# EAGLE design TalonSRXBreakoutV1 (EAGLE 7.5.0)
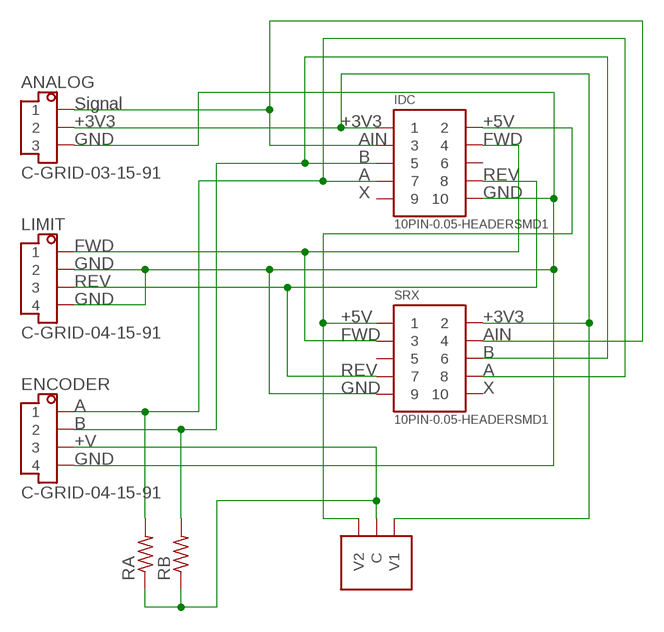
[diagram p0: schematic, sheet 1]

## Parts
ANALOG  C-GRID-03-15-91  [15-91-03]
ENCODER  C-GRID-04-15-91  [15-91-04]
IDC  10PIN-0.05-HEADERSMD1  [1.27-10PIN]
LIMIT  C-GRID-04-15-91  [15-91-04]
RA  R-US_R0805  [R0805]
RB  R-US_R0805  [R0805]
SRX  10PIN-0.05-HEADERSMD1  [1.27-10PIN]
U$1  3PIN-RA-VSELECT  [2.54-3PIN-SMD-RA]

## Nets
N$1: ANALOG.1 IDC.P3 SRX.P4
N$2: ANALOG.3 ENCODER.4 IDC.P10 LIMIT.2 LIMIT.4 SRX.P9
N$3: ANALOG.2 IDC.P1 SRX.P2 U$1.P1(V1)
N$4: IDC.P8 LIMIT.3 SRX.P7
N$5: IDC.P4 LIMIT.1 SRX.P3
N$7: ENCODER.1 IDC.P7 RA.2 SRX.P8
N$8: ENCODER.2 IDC.P5 RB.2 SRX.P6
N$11: IDC.P2 SRX.P1 U$1.P3(V2)
N$12: ENCODER.3 RA.1 RB.1 U$1.P2(C)
Unconnected: IDC.P6 IDC.P9 SRX.P5 SRX.P10

## Notes on the sheet
- Signal
- +3V3 | +3V3 | +5V
- GND | AIN | FWD
- B
- A | REV
- X | GND
- FWD
- GND
- REV
- GND
- +5V | +3V3
- FWD | AIN
- B
- REV | A
- GND | X
- A
- B
- +V
- GND

## Library data of the parts
ANALOG = con-molex:C-GRID-03: CONNECTOR wire to board 2.54 mm (0.100") pitch header; OC_FARNELL: unknown; OC_NEWARK: unknown
ENCODER LIMIT = con-molex:C-GRID-04: CONNECTOR wire to board 2.54 mm (0.100") pitch header; OC_FARNELL: unknown; OC_NEWARK: unknown
IDC SRX = con-CNC:10PIN-0.05-HEADER: Simple SMD 0.05" 10 pin header
RA RB = rcl:R-US_: RESISTOR, American symbol
U$1 = con-CNC:3PIN-RA-VSELECT

## Board
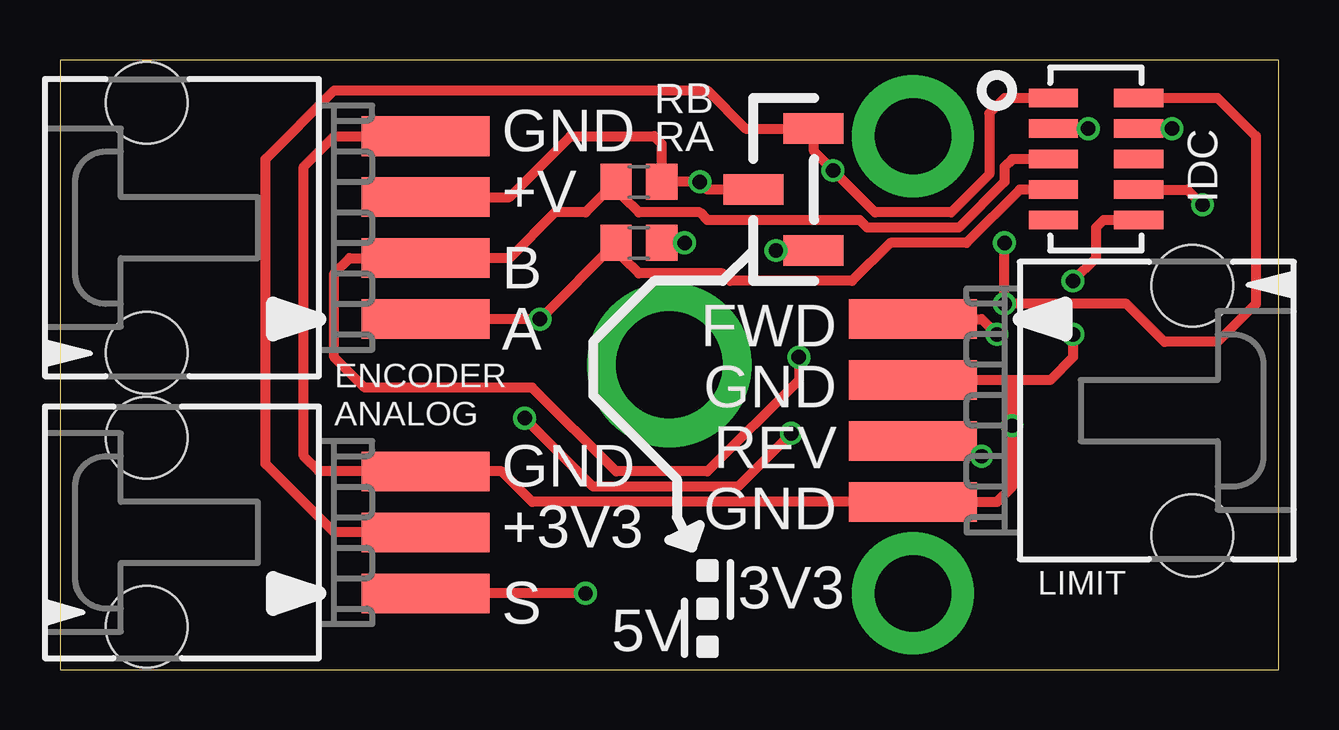
[diagram p1: board, top side]
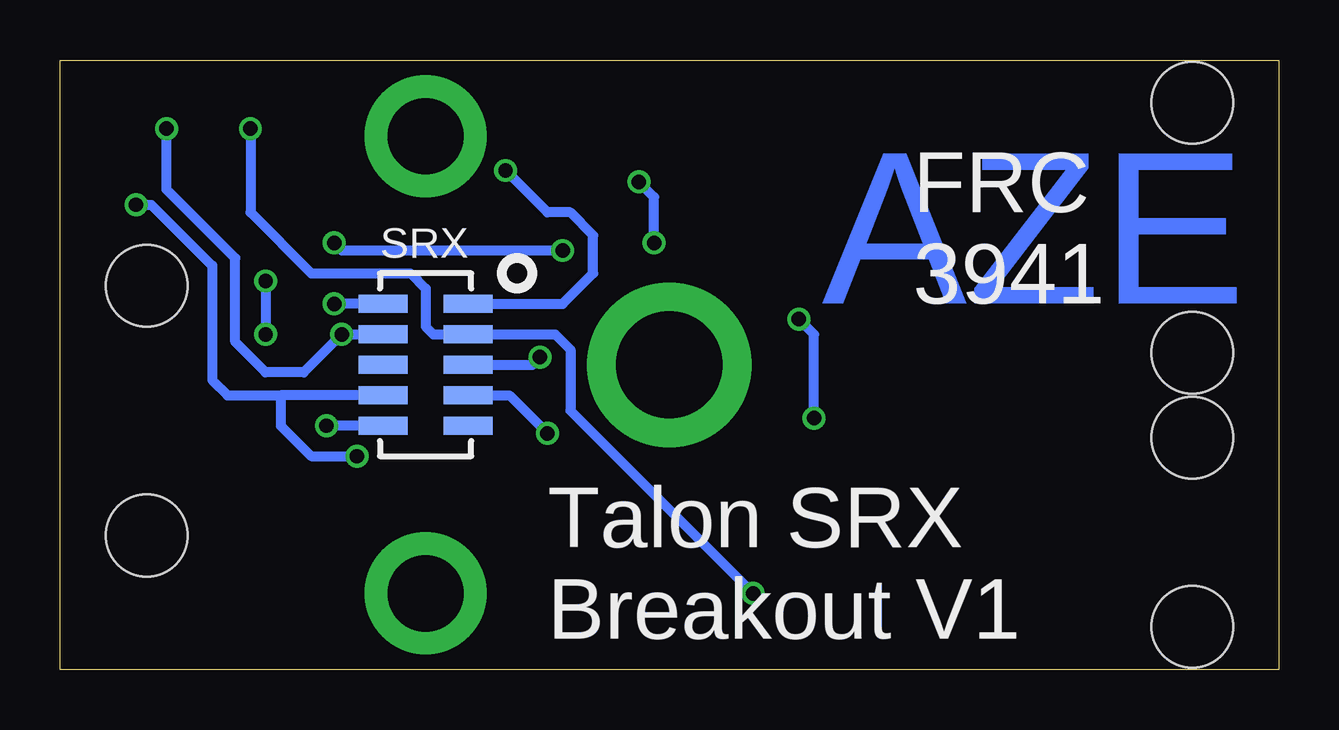
[diagram p2: board, bottom side, seen from below]

Size 50.8 x 25.4 mm. Coordinates in mm from the lower left corner, seen from the top.
Outline: 0,0 50.8,0 50.8,25.4 0,25.4 0,0
Copper layers (1*16): Top 0.0356mm / dielectric 1.5011mm / Bottom 0.0356mm
Design rules "LaenPCBOrder *": minimum track width 6mil, minimum drill 13mil, track to track 6mil, track to pad 6mil, pad to pad 6mil, via to via 6mil, smd to smd 0mil, copper to edge 15mil, drill to drill 6mil, minimum pad ring 7mil, minimum via ring 7mil, stop-mask expansion 3mil, vias tented up to drill 500mil, thermal gap 10mil

### Footprints (pad centres in the part's own frame; a part is rotated, then mirrored left to right if it is on the bottom)
15-91-03 = smd 1.651 x 5.334: 1 -2.54,-10.795; 2 0,-10.795; 3 2.54,-10.795 | hole 3.404: -3.937,0.838; 3.937,0.838
15-91-04 = smd 1.651 x 5.334: 1 -3.81,-10.795; 2 -1.27,-10.795; 3 1.27,-10.795; 4 3.81,-10.795 | hole 3.404: -5.207,0.838; 5.207,0.838
1.27-10PIN = smd 0.76 x 2.05: P1 2.54,1.775; P2 2.54,-1.775; P3 1.27,1.775; P4 1.27,-1.775; P5 0,1.775; P6 0,-1.775; P7 -1.27,1.775; P8 -1.27,-1.775; P9 -2.54,1.775; P10 -2.54,-1.775
R0805 = smd 1.3 x 1.5: 1 -0.95,0; 2 0.95,0
2.54-3PIN-SMD-RA = smd 1.27 x 2.5: P1 -2.54,1.25; P2 0,-1.25; P3 2.54,1.25

### Placement (x,y rotation side)
ANALOG  4.45,5.71 90 top
ENCODER  4.45,18.41 90 top
IDC  43.18,21.27 90 top
LIMIT  46.35,10.79 270 top
RA  24.13,17.78 180 top
RB  24.13,20.32 180 top
SRX  35.56,12.7 90 bottom
U$1  30.16,20 270 top

### Tracks (layer width: path | path; a pad name or v marks a point on that pad's centre or on a via)
N$1  (via drill 0.6)
  Top 0.406: IDC.P3 v42.86,22.54 | v21.91,3.17 ANALOG.1
  Bottom 0.406: v42.86,22.54 42.86,19.05 40.32,16.51 36.2,16.51 35.56,15.88 35.56,14.29 35.24,13.97 SRX.P4 30.16,13.97 29.53,13.34 29.53,10.79 v21.91,3.17
N$2  (via drill 0.6)
  Top 0.406: IDC.P10 43.5,18.73 43.18,18.41 43.18,17.14 v42.23,16.19 | v42.23,13.97 42.23,13.02 41.27,12.06 39.69,12.06 | 39.69,12.06 LIMIT.2 | 39.69,12.06 v39.69,10.16 39.69,7.62 39.05,6.99 LIMIT.4 19.68,6.99 18.41,8.26 ANALOG.3 10.79,8.26 10.16,8.89 10.16,20.95 11.43,22.23 ENCODER.4
  Bottom 0.406: v42.23,16.19 v42.23,13.97 | SRX.P9 v39.69,10.16
N$3  (via drill 0.6)
  Top 0.406: IDC.P1 39.37,23.81 38.73,23.18 38.73,20.64 37.15,19.05 33.97,19.05 v32.23,20.8 31.43,21.59 31.43,22.52 U$1.P1 28.57,22.54 26.99,24.13 11.43,24.13 8.57,21.27 8.57,8.57 11.43,5.71 ANALOG.2
  Bottom 0.406: SRX.P2 29.84,15.24 28.57,16.51 28.57,18.1 29.53,19.05 30.48,19.05 v32.23,20.8
N$4  (via drill 0.6)
  Top 0.406: IDC.P8 46.99,20 v47.62,19.37 | v38.42,8.89 36.2,8.89 LIMIT.3
  Bottom 0.406: v47.62,19.37 46.99,19.37 44.45,16.83 44.45,12.06 43.81,11.43 41.59,11.43 | SRX.P7 41.59,11.43 | 41.59,11.43 41.59,10.16 40.32,8.89 v38.42,8.89
N$5  (via drill 0.6)
  Top 0.406: LIMIT.1 38.42,14.61 v39.05,13.97 | IDC.P4 v46.35,22.54
  Bottom 0.406: SRX.P3 v39.05,13.97 40.64,12.38 42.23,12.38 43.5,13.65 43.5,17.14 46.35,20 v46.35,22.54
N$6  (via drill 4.45 pad 6.86)
  other vias: 25.4,12.7
N$7  (via drill 0.6)
  Top 0.406: IDC.P7 40.01,20 37.78,17.78 34.61,17.78 33.02,16.19 27.94,16.19 27.62,16.51 24.13,16.51 23.5,17.14 23.5,17.46 RA.2 v20,14.61 ENCODER.1 | v30.48,9.84 28.26,7.62 22.23,7.62 v19.37,10.48
  Bottom 0.406: SRX.P8 32.07,11.43 v30.48,9.84 | v19.37,10.48 19.37,13.97 v20,14.61
N$8  (via drill 0.6)
  Top 0.406: IDC.P5 39.69,21.27 39.37,20.95 39.37,20.32 37.47,18.41 33.66,18.41 33.34,18.73 26.99,18.73 26.67,19.05 24.13,19.05 23.5,19.68 23.5,20 RB.2 21.91,19.05 20.64,19.05 18.73,17.14 15.88,17.14 ENCODER.2 12.06,17.14 11.43,16.51 11.43,13.02 12.7,11.75 19.68,11.75 23.18,8.26 26.99,8.26 30.8,12.06 v30.8,13.02
  Bottom 0.406: SRX.P6 31.11,12.7 v30.8,13.02
N$9  (via drill 3.17 pad 5.08)
  other vias: 35.56,22.23
N$10  (via drill 3.17 pad 5.08)
  other vias: 35.56,3.17
N$11  (via drill 0.6)
  Top 0.406: U$1.P3 v29.84,17.46 | IDC.P2 48.26,23.81 49.85,22.23 49.85,15.24 48.26,13.65 46.04,13.65 44.45,15.24 v39.37,15.24 v39.37,17.78
  Bottom 0.406: v29.84,17.46 39.05,17.46 v39.37,17.78 | SRX.P1 v39.37,15.24
N$12  (via drill 0.6)
  Top 0.406: RA.1 v26.04,17.78 | U$1.P2 26.99,20 v26.67,20.32 RB.1 25.08,21.91 24.77,22.23 21.27,22.23 18.73,19.68 ENCODER.3
  Bottom 0.406: v26.04,17.78 26.04,19.68 v26.67,20.32

### Text on the board
Bottom: AZE
tPlace: 5V | 3V3
bPlace: FRC / 3941 | Talon SRX / Breakout V1
tNames: GND | +V | B | FWD | A | GND | REV | GND | GND | +3V3 | S